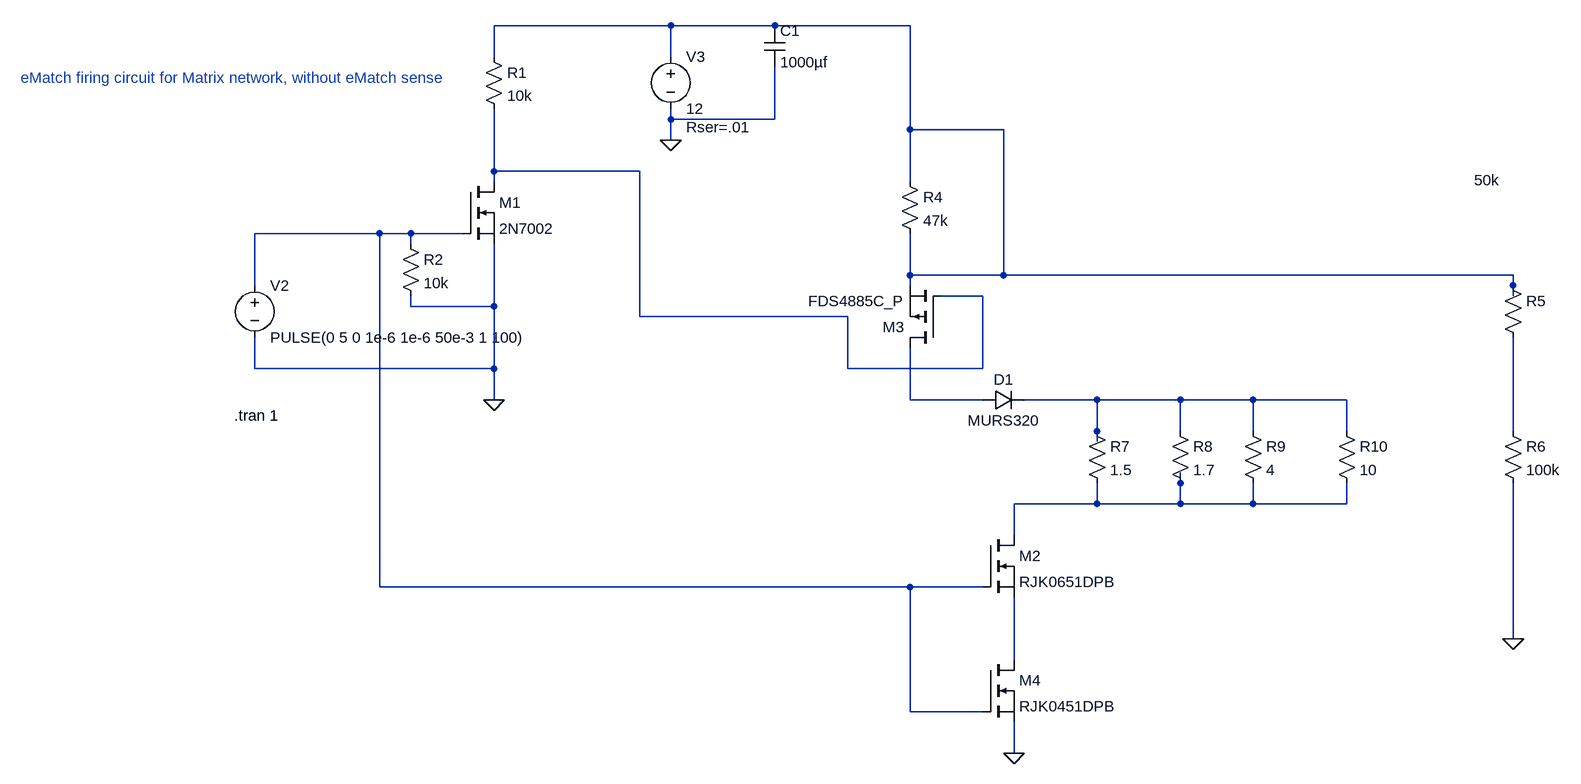
[diagram p0: schematic MatrixSenseGoodEmatch.asc]
MatrixSenseGoodEmatch.asc, the LTspice schematic file:
Version 4
SHEET 1 1812 1044
WIRE 432 -96 160 -96
WIRE 592 -96 432 -96
WIRE 800 -96 592 -96
WIRE 160 -48 160 -96
WIRE 432 -48 432 -96
WIRE 432 48 432 32
WIRE 592 48 592 -32
WIRE 592 48 432 48
WIRE 800 64 800 -96
WIRE 944 64 800 64
WIRE 432 80 432 48
WIRE 160 128 160 32
WIRE 384 128 160 128
WIRE 160 144 160 128
WIRE 800 144 800 64
WIRE -16 224 -208 224
WIRE 32 224 -16 224
WIRE 112 224 32 224
WIRE 32 240 32 224
WIRE 800 288 800 224
WIRE 944 288 944 64
WIRE 944 288 800 288
WIRE 1728 288 944 288
WIRE -208 304 -208 224
WIRE 800 304 800 288
WIRE 1728 304 1728 288
WIRE 912 320 848 320
WIRE 1728 320 1728 304
WIRE 32 336 32 320
WIRE 160 336 160 240
WIRE 160 336 32 336
WIRE 384 352 384 128
WIRE 704 352 384 352
WIRE -208 432 -208 384
WIRE 160 432 160 336
WIRE 160 432 -208 432
WIRE 704 432 704 352
WIRE 912 432 912 320
WIRE 912 432 704 432
WIRE 160 480 160 432
WIRE 800 480 800 400
WIRE 912 480 800 480
WIRE 1088 480 976 480
WIRE 1216 480 1088 480
WIRE 1328 480 1216 480
WIRE 1472 480 1328 480
WIRE 1088 528 1088 480
WIRE 1216 528 1216 480
WIRE 1328 528 1328 480
WIRE 1472 528 1472 480
WIRE 1728 528 1728 384
WIRE 1088 544 1088 528
WIRE 1216 608 1216 592
WIRE 1088 640 1088 608
WIRE 1088 640 960 640
WIRE 1216 640 1216 608
WIRE 1216 640 1088 640
WIRE 1328 640 1328 608
WIRE 1328 640 1216 640
WIRE 1472 640 1472 608
WIRE 1472 640 1328 640
WIRE 960 688 960 640
WIRE -16 768 -16 224
WIRE 800 768 -16 768
WIRE 912 768 800 768
WIRE 1728 848 1728 608
WIRE 960 880 960 784
WIRE 800 960 800 768
WIRE 912 960 800 960
WIRE 960 1024 960 976
FLAG 160 480 0
FLAG 432 80 0
FLAG 1728 848 0
FLAG 960 1024 0
SYMBOL nmos 112 144 R0
SYMATTR InstName M1
SYMATTR Value 2N7002
SYMBOL res 144 -64 R0
SYMATTR InstName R1
SYMATTR Value 10k
SYMBOL res 16 224 R0
SYMATTR InstName R2
SYMATTR Value 10k
SYMBOL voltage -208 288 R0
WINDOW 123 0 0 Left 2
WINDOW 39 0 0 Left 2
SYMATTR InstName V2
SYMATTR Value PULSE(0 5 0 1e-6 1e-6 50e-3 1 100)
SYMBOL voltage 432 -64 R0
WINDOW 123 0 0 Left 2
WINDOW 39 24 124 Left 2
SYMATTR SpiceLine Rser=.01
SYMATTR InstName V3
SYMATTR Value 12
SYMBOL pmos 848 400 R180
SYMATTR InstName M3
SYMATTR Value FDS4885C_P
SYMBOL nmos 912 688 R0
SYMATTR InstName M2
SYMATTR Value RJK0651DPB
SYMBOL res 784 128 R0
SYMATTR InstName R4
SYMATTR Value 47k
SYMBOL res 1712 288 R0
WINDOW 3 -44 -146 Left 2
SYMATTR Value 50k
SYMATTR InstName R5
SYMBOL res 1712 512 R0
SYMATTR InstName R6
SYMATTR Value 100k
SYMBOL nmos 912 880 R0
SYMATTR InstName M4
SYMATTR Value RJK0451DPB
SYMBOL cap 576 -96 R0
SYMATTR InstName C1
SYMATTR Value 1000µf
SYMBOL res 1072 512 R0
SYMATTR InstName R7
SYMATTR Value 1.5
SYMBOL res 1200 512 R0
SYMATTR InstName R8
SYMATTR Value 1.7
SYMBOL res 1312 512 R0
SYMATTR InstName R9
SYMATTR Value 4
SYMBOL res 1456 512 R0
SYMATTR InstName R10
SYMATTR Value 10
SYMBOL diode 912 496 R270
WINDOW 0 32 32 VTop 2
WINDOW 3 0 32 VBottom 2
SYMATTR InstName D1
SYMATTR Value MURS320
TEXT -240 504 Left 2 !.tran 1
TEXT -568 -16 Left 2 ;eMatch firing circuit for Matrix network, without eMatch sense

The netlist it stands for:
* MatrixSenseGoodEmatch.asc
M1 N002 N003 0 0 2N7002
R1 N001 N002 10k
R2 N003 0 10k
V2 N003 0 PULSE(0 5 0 1e-6 1e-6 50e-3 1 100)
V3 N001 0 12 Rser=.01
M3 N004 N002 N001 N001 FDS4885C_P
M2 N007 N003 N008 N008 RJK0651DPB
R4 N001 N001 47k
R5 N001 N006 50k
R6 N006 0 100k
M4 N008 N003 0 0 RJK0451DPB
C1 N001 0 1000µf
R7 N005 N007 1.5
R8 N005 N007 1.7
R9 N005 N007 4
R10 N005 N007 10
D1 N004 N005 MURS320
.model D D
.lib standard.dio
.model NMOS NMOS
.model PMOS PMOS
.lib standard.mos
.tran 1
* eMatch firing circuit for Matrix network, without eMatch sense
.backanno
.end